# Altium schematic sheet UBC-Thunderbots_PCB_Power__archive_chicker-v1.0_pcb__Flyback.SchDoc
size A4
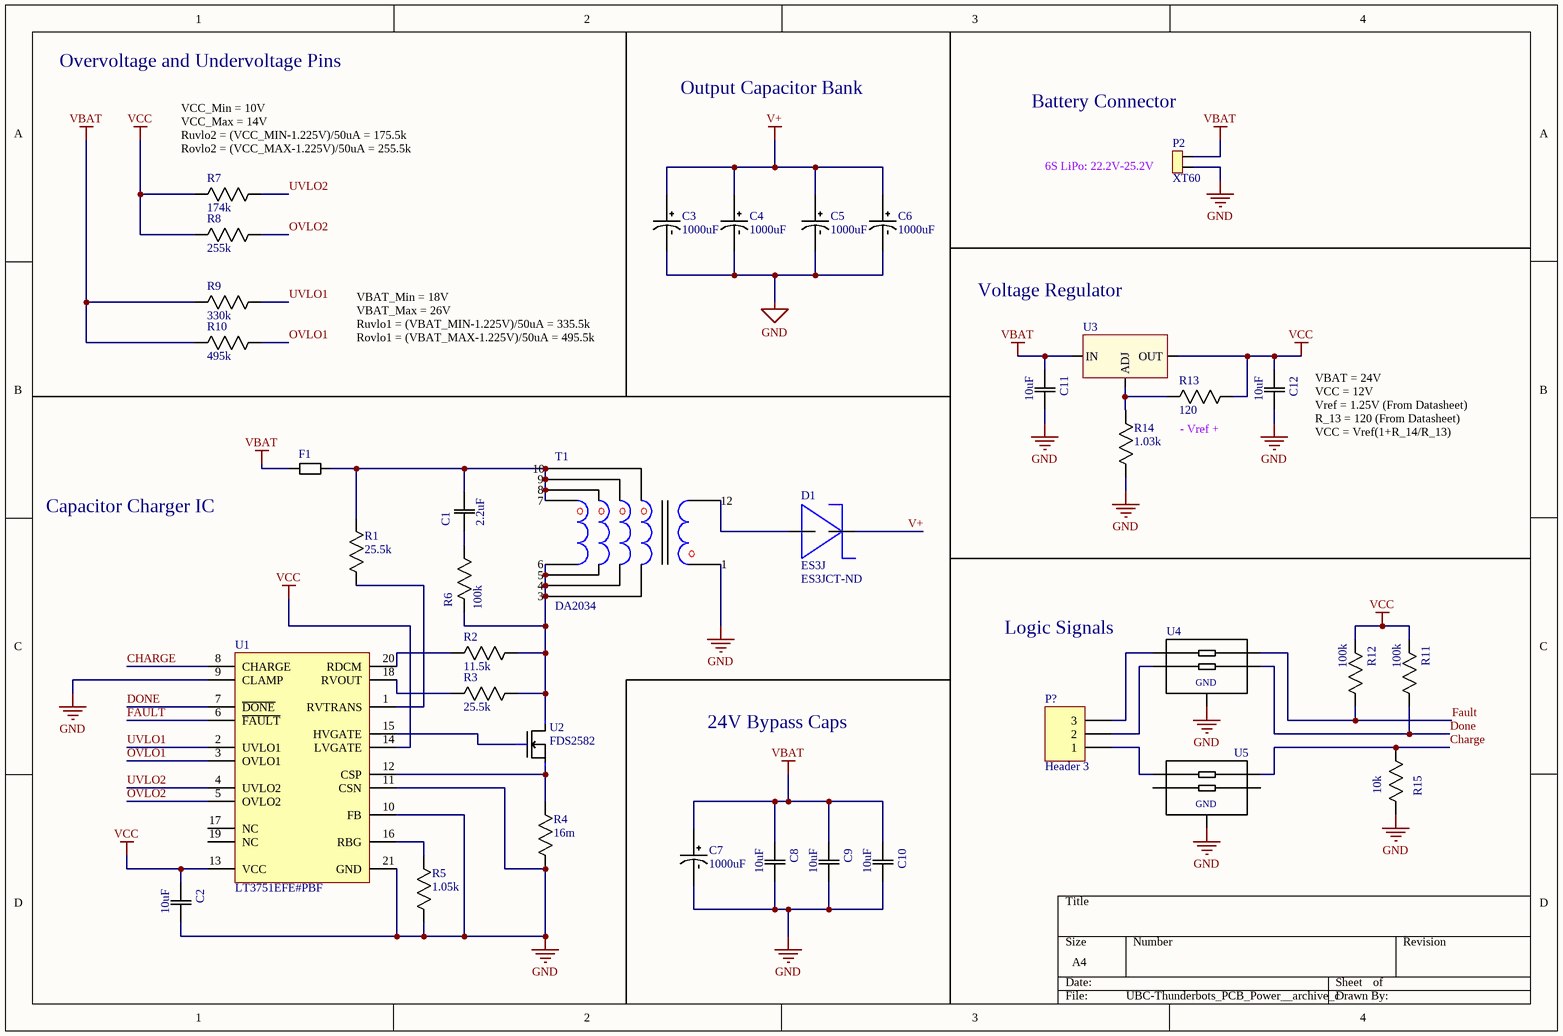
[diagram p0: UBC-Thunderbots_PCB_Power__archive_chicker-v1.0_pcb__Flyback.SchDoc]

## Parts
C1  2.2uF  [0805]
C2  10uF  [0805]
C3  1000uF  [CAP POL 1000uF THRU]
C4  1000uF  [CAP POL 1000uF THRU]
C5  1000uF  [CAP POL 1000uF THRU]
C6  1000uF  [CAP POL 1000uF THRU]
C7  1000uF  [CAP POL 1000uF THRU]
C8  10uF  [0805]
C9  10uF  [0805]
C10  10uF  [0805]
C11  10uF  [1210]
C12  10uF  [1210]
D1  ES3J  Supplier Part Number 1: ES3JCT-ND  [D0214-AB]
F1  Fuse 20A 1206  [1206]  (value not drawn)
P2  XT60  [XT60Connector]
P?  Header 3  [HDR1X3]
R1  25.5k  [0805]
R2  11.5k  [0805]
R3  25.5k  [0805]
R4  16m  [0805]
R5  1.05k  [0805]
R6  100k  [0805]
R7  174k  [0805]
R8  255k  [0805]
R9  330k  [0805]
R10  495k  [0805]
R11  100k  [0805]
R12  100k  [0805]
R13  120  [0805]
R14  1.03k  [0805]
R15  10k  [0805]
T1  DA2034  [DA2034]
U1  LT3751EFE#PBF  [LT-FE-20-EPV-CB_L]
U2  FDS2582  [8-SOIC MOSFET]
U3  LD1084V  [*TO-220]  (value not drawn)
U4  EMI  [SOT-665]  (value not drawn)
U5  EMI  [SOT-665]  (value not drawn)

## Nets
GND: C2.2(C2) C3.NEG C4.NEG C5.NEG C6.NEG C7.NEG C8.2(C2) C9.2(C2) C10.2(C2) C11.2(C2) C12.2(C2) P2.1 R4.2(R2) R5.2(R2) R14.2(R2) R15.1(R1) T1.1 U1.9(CLAMP) U1.10(FB) U1.11(CSN) U1.21(GND) U4.2(P$2) U5.2(P$2)
V+: C3.POS C4.POS C5.POS C6.POS D1.OUT
VBAT: C7.POS C8.1(C1) C9.1(C1) C10.1(C1) C11.1(C1) F1.1 P2.2 R9.2(R2) R10.2(R2) U3.1(IN)
VCC: C2.1(C1) C12.1(C1) R7.2(R2) R8.2(R2) R11.2(R2) R12.2(R2) R13.1(R1) U1.13(VCC) U1.14(LVGATE) U3.3(OUT)
CHARGE: R15.2(R2) U1.8(CHARGE) U5.5(P$5)
DONE: R11.1(R1) U1.7(~{DONE}) U4.4(P$4)
FAULT: R12.1(R1) U1.6(~{FAULT}) U4.5(P$5)
OVLO1: R10.1(R1) U1.3(OVLO1)
OVLO2: R8.1(R1) U1.5(OVLO2)
UVLO1: R9.1(R1) U1.2(UVLO1)
UVLO2: R7.1(R1) U1.4(UVLO2)
NetC1_1: C1.1(C1) R6.1(R1)
NetC1_2: C1.2(C2) F1.2 R1.1(R1) T1.7 T1.8 T1.9 T1.10
NetD1_IN: D1.IN T1.12
NetP?_1: P?.1 U5.1(P$1)
NetP?_2: P?.2 U4.3(P$3)
NetP?_3: P?.3 U4.1(P$1)
NetR1_2: R1.2(R2) U1.1(RVTRANS)
NetR2_1: R2.1(R1) R3.1(R1) R6.2(R2) T1.3 T1.4 T1.5 T1.6 U2.D
NetR2_2: R2.2(R2) U1.20(RDCM)
NetR3_2: R3.2(R2) U1.18(RVOUT)
NetR4_1: R4.1(R1) U1.12(CSP) U2.S
NetR5_1: R5.1(R1) U1.16(RBG)
NetR13_2: R13.2(R2) R14.1(R1) U3.2(ADJ)
NetU1_15: U1.15(HVGATE) U2.G

Not connected (* = marked no-connect by the designer): U1 17(NC) 19(NC); U5 3(P$3) 4(P$4)

## Notes on the sheet
- Overvoltage and Undervoltage Pins
- Output Capacitor Bank
- (near P2) Battery Connector
- (near R7) VCC_Min = 10V
  VCC_Max = 14V
  Ruvlo2 = (VCC_MIN-1.225V)/50uA = 175.5k
  Rovlo2 = (VCC_MAX-1.225V)/50uA = 255.5k
- (near P2) 6S LiPo: 22.2V-25.2V
- Voltage Regulator
- VBAT_Min = 18V
  VBAT_Max = 26V
  Ruvlo1 = (VBAT_MIN-1.225V)/50uA = 335.5k
  Rovlo1 = (VBAT_MAX-1.225V)/50uA = 495.5k
- (near R13) - Vref +
- (near C12) VBAT = 24V
  VCC = 12V
  Vref = 1.25V (From Datasheet)
  R_13 = 120 (From Datasheet)
  VCC = Vref(1+R_14/R_13)
  R_14 = R_13(VCC/Vref - 1) = 1.03k
- Capacitor Charger IC
- (near U4) Logic Signals
- 24V Bypass Caps
- (in symbol EMI FILTER IP4256CZ5-W) GND

## Library data of the parts
C1 = CAP 2.2uF 0805: CAP CER 1UF 50V X7R 0805; MP: C0805C225K4RACTU; MF: KEMET; Tolerance: 10%; Rating: 16V; Package: 0805; Price: 0,461 CAD; Value: 2.2uF; Digikey: 399-3523-1-ND; Digikey Link: https://www.digikey.ca/products/en?keywords=399-3523-1-ND
C2 C8-C10 = CAP 10uF 0805: CAP CER 10UF 10V X5R 0805; MP: C0805C106K8PACTU; MF: KEMET; Tolerance: 10%; Package: 0805; Price: 0.168 CAD; Value: 10uF; Digikey: 399-4925-1-ND; Digikey Link: https://www.digikey.ca/product-detail/en/kemet/C0805C106K8PACTU/399-4925-1-ND/1090920; Rating: 10V
C3-C7 = CAP POL 1000uF THRU: NICHICON   UVR1E102MPD1TD   ALUMINUM ELECTROLYTIC CAPACITOR, 1000UF, 25V, 20%, RADIAL, FULL REEL; Dielectric Material: Aluminium; Life (Hours): 2000Hour; Capacitance: 1mF; Leakage Current: 750uA; Dissipation Factor: 0.16%; Ripple Current: 960mA; Lead Diameter: 0.6mm; Supplier 1: Digi-Key; Manufacturer: Nichicon; Manufacturer Part Number: UVR1E102MPD1TD; RoHS: Yes; Category: Aluminum Electrolytic Capacitors; Stock 1: 43448; Pricing 1: 1=0.58000, 10=0.40800, 100=0.26890 (USD); Mount: Through Hole,PCB; Case/Package: Radial; Number of Pins: 2; Min Operating Temperature: -40°C; Max Operating Temperature: 85°C; Packaging: Tape and Reel; Tolerance: 20%; Voltage Rating (DC): 25V; Voltage Rating: 25V; Termination: Radial; Voltage: 25V; Package Quantity: 500; Diameter: 10mm; Length: 20mm; Height: 20mm; Height - Seated (Max): 0.866inch; Lead Pitch: 5mm; Radiation Hardening: No; REACH SVHC: No SVHC; Lead Free: Lead Free; ComponentLink1URL: https://datasheet.ciiva.com/7851/e-vr-7851718.pdf?src-supplier=Element14; ComponentLink1Description: https://datasheet.ciiva.com/7851/e-vr-7851718.pdf?src-supplier=Element14; ComponentLink2URL: https://datasheet.ciiva.com/6300/e-vr-6300009.pdf?src-supplier=Digi-Key; ComponentLink2Description: https://datasheet.ciiva.com/6300/e-vr-6300009.pdf?src-supplier=Digi-Key; ComponentLink3URL: https://datasheet.ciiva.com/6300/e-vr-6300010.pdf?src-supplier=Digi-Key; ComponentLink3Description: https://datasheet.ciiva.com/6300/e-vr-6300010.pdf?src-supplier=Digi-Key; ComponentLink4URL: https://datasheet.ciiva.com/11684/e-vr-11684106.pdf?src-supplier=Avnet; ComponentLink4Description: https://datasheet.ciiva.com/11684/e-vr-11684106.pdf?src-supplier=Avnet; ComponentLink5URL: https://datasheet.ciiva.com/16502/e-vr-16502813.pdf?src-supplier=Future+Electronics; ComponentLink5Description: https://datasheet.ciiva.com/16502/e-vr-16502813.pdf?src-supplier=Future+Electronics; ComponentLink6URL: https://datasheet.ciiva.com/46381/1909356-46381757.pdf?src-supplier=Element14; ComponentLink6Description: https://datasheet.ciiva.com/46381/1909356-46381757.pdf?src-supplier=Element14; Supplier Part Number 1: 493-5913-1-ND
C11 C12 = CAP 10uF 50V: CAP CER 10UF 50V X7R; Tolerance: 10%; Package: 1210; Value: 10uF; Rating: 50V; ComponentLink1Description: digikey; ComponentLink1URL: https://www.digikey.ca/en/products/detail/kemet/C1210C106M5RACTU/4918883
D1 = ES3J: Diode Switching 600V 3A 2-Pin DO-214AB T/R; Manufacturer: ON Semiconductor / Fairchild; Element Configuration: Single; Power Dissipation: 1.66W; Reverse Recovery Time: 35ns; Peak Non-Repetitive Surge Current: 100A; Polarity: Standard; Capacitance: 45pF; Forward Voltage: 1.7V; Peak Reverse Current: 10uA; Supplier 1: Digi-Key; Manufacturer Part Number: ES3J; RoHS: Yes; Category: Zener Diodes; Stock 1: 20740; Pricing 1: 1=0.47000, 10=0.37800, 25=0.34600, 100=0.21740, 250=0.21492, 500=0.20126, 1000=0.13685 (USD); Mount: Surface Mount; Case/Package: SMC; Number of Pins: 2; Contact Plating: Tin,Matte; Min Operating Temperature: -50°C; Max Operating Temperature: 150°C; Reverse Voltage: 600V; Max Reverse Voltage (DC): 600V; Average Rectified Current: 3A; Max Repetitive Reverse Voltage (Vrrm): 600V; Max Forward Surge Current (Ifsm): 100A; Current: 3A; Voltage: 600V; Voltage Rating (DC): 600V; Current Rating: 3A; Output Current: 3A; Max Surge Current: 100A; Packaging: Tape and Reel; Package Quantity: 3000; Recovery Time: 35ns; Forward Current: 3A; Length: 7.11mm; Height: 2.616mm; Width: 6.223mm; Radiation Hardening: No; REACH SVHC: No SVHC; Lead Free: Lead Free; ComponentLink1URL: https://datasheet.ciiva.com/4452/es3j-187547-4452440.pdf?src-supplier=Mouser; ComponentLink1Description: https://datasheet.ciiva.com/4452/es3j-187547-4452440.pdf?src-supplier=Mouser; ComponentLink2URL: https://datasheet.ciiva.com/30479/0900766b810e1d0b-30479500.pdf?src-supplier=RSComponents; ComponentLink2Description: https://datasheet.ciiva.com/30479/0900766b810e1d0b-30479500.pdf?src-supplier=RSComponents; ComponentLink3URL: https://datasheet.ciiva.com/22651/1856389-22651960.pdf?src-supplier=Element14; ComponentLink3Description: https://datasheet.ciiva.com/22651/1856389-22651960.pdf?src-supplier=Element14; ComponentLink4URL: https://datasheet.ciiva.com/26230/es3j-26230952.pdf?src-supplier=Avnet+Europe; ComponentLink4Description: https://datasheet.ciiva.com/26230/es3j-26230952.pdf?src-supplier=Avnet+Europe; ComponentLink5URL: https://datasheet.ciiva.com/911/es3a-911003.pdf?src-supplier=Digi-Key; ComponentLink5Description: https://datasheet.ciiva.com/911/es3a-911003.pdf?src-supplier=Digi-Key; ComponentLink6URL: https://datasheet.ciiva.com/911/es3a-911004.pdf?src-supplier=Digi-Key; ComponentLink6Description: https://datasheet.ciiva.com/911/es3a-911004.pdf?src-supplier=Digi-Key; ComponentLink7URL: https://datasheet.ciiva.com/23683/1856389-23683564.pdf?src-supplier=Newark; ComponentLink7Description: https://datasheet.ciiva.com/23683/1856389-23683564.pdf?src-supplier=Newark; ComponentLink8URL: https://datasheet.ciiva.com/17194/es3j-17194703.pdf?src-supplier=Future+Electronics; ComponentLink8Description: https://datasheet.ciiva.com/17194/es3j-17194703.pdf?src-supplier=Future+Electronics; ComponentLink9URL: https://datasheet.ciiva.com/7965/1856389-7965165.pdf?src-supplier=Element14; ComponentLink9Description: https://datasheet.ciiva.com/7965/1856389-7965165.pdf?src-supplier=Element14; ComponentLink10URL: https://datasheet.ciiva.com/8300/es3j-8300861.pdf?src-supplier=Avnet; ComponentLink10Description: https://datasheet.ciiva.com/8300/es3j-8300861.pdf?src-supplier=Avnet
F1 = FUSE 20A 63V SLOW: FUSE 20A 32V AC 63V DC 1206; Response Time: Slow Blow; Current Rating (Amps): 20A; Voltage Rating - AC: 32V; Voltage Rating - DC: 63V; Operating Temperature: -55°C ~ 90°C
P2 = XT60 Connector: XT60 CONNECTORS FEMALE PAIR; MF: SparkFun Electronics; MP: PRT-10474; Digikey: 1568-1816-ND; Digikey Link: https://www.digikey.ca/product-detail/en/sparkfun-electronics/PRT-10474/1568-1816-ND/8258064; Package: XT60; Price: 2.13000 CAD; Value: N/A
P? = Header 3: Header, 3-Pin; LatestRevisionDate: 17-Jul-2002; LatestRevisionNote: Re-released for DXP Platform.; Publisher: Altium Limited
R1 R3 = RES 25.5k 0805: 0805 Resistor, 6A, 0.125W, 25ppm, 0.1%, 25K5; Manufacturer: Panasonic; Manufacturer Part Number: ERA-6AEB2552V; Temperature Coefficient: 25ppm/°C; Max Power Dissipation: 125mW; Resistance: 25.5kR; Voltage Rating: 100V; Supplier 1: Digi-Key; RoHS: Yes; Category: Chip SMD Resistors; Stock 1: 5872; Pricing 1: 1=0.36000, 10=0.30200, 100=0.11820, 1000=0.04948, 2500=0.04536 (USD); Mount: Surface Mount; Case/Package: 0805; Number of Pins: 2; Case Code (Imperial): 0805; Case Code (Metric): 2012; Contact Plating: Tin; Min Operating Temperature: -55°C; Max Operating Temperature: 155°C; Number of Terminations: 2; Features: Automotive AEC-Q200; Tolerance: 0.1%; Composition: Metal Film,Thin Film; Packaging: Tape and Reel; Military Standard: Not; Termination: Solder; Power Rating: 125mW; Package Quantity: 1; Voltage Rating (DC): 100V; Length: 2mm; Height: 0.5mm; Width: 1.25mm; Depth: 1.25mm; Radiation Hardening: No; Lead Free: Lead Free; ComponentLink1URL: https://datasheet.ciiva.com/11810/0900766b80eb1d8c-11810651.pdf?src-supplier=RSComponents; ComponentLink1Description: https://datasheet.ciiva.com/11810/0900766b80eb1d8c-11810651.pdf?src-supplier=RSComponents; ComponentLink2URL: https://datasheet.ciiva.com/26335/459526-da-01-en-widerstand-0805-era-26335831.pdf?src-supplier=Conrad; ComponentLink2Description: https://datasheet.ciiva.com/26335/459526-da-01-en-widerstand-0805-era-26335831.pdf?src-supplier=Conrad; ComponentLink3URL: https://datasheet.ciiva.com/7870/485442-7870651.pdf?src-supplier=Element14; ComponentLink3Description: https://datasheet.ciiva.com/7870/485442-7870651.pdf?src-supplier=Element14; ComponentLink4URL: https://datasheet.ciiva.com/5987/485442-5987308.pdf?src-supplier=Farnell; ComponentLink4Description: https://datasheet.ciiva.com/5987/485442-5987308.pdf?src-supplier=Farnell; ComponentLink5URL: https://datasheet.ciiva.com/7870/485442-7870652.pdf?src-supplier=Element14; ComponentLink5Description: https://datasheet.ciiva.com/7870/485442-7870652.pdf?src-supplier=Element14; ComponentLink6URL: https://datasheet.ciiva.com/30151/54aoa0000ce26-30151583.pdf?src-supplier=Onlinecomponents.com; ComponentLink6Description: https://datasheet.ciiva.com/30151/54aoa0000ce26-30151583.pdf?src-supplier=Onlinecomponents.com; ComponentLink7URL: https://datasheet.ciiva.com/9191/aoa0000ce26-9191422.pdf?src-supplier=Avnet; ComponentLink7Description: https://datasheet.ciiva.com/9191/aoa0000ce26-9191422.pdf?src-supplier=Avnet; Supplier Part Number 1: P25.5KDACT-ND
R2 = RES 11.5k 0805: Res Thin Film 0805 11.5K Ohm 0.1% 1/8W 25ppm/C Molded SMD SMD Punched Carrier T/R; Manufacturer: Panasonic; Manufacturer Part Number: ERA-6AEB1152V; Power Rating: 125mW; Resistance: 11.5kR; Voltage Rating: 100V; Temperature Coefficient: 25ppm/°C; Supplier 1: Digi-Key; RoHS: Yes; Category: Chip SMD Resistors; Stock 1: 10661; Pricing 1: 1=0.34000, 10=0.28800, 100=0.11260, 1000=0.04712, 2500=0.04320 (USD); Mount: Surface Mount; Case/Package: 0805; Number of Pins: 2; Case Code (Metric): 2012; Case Code (Imperial): 0805; Contact Plating: Tin; Min Operating Temperature: -55°C; Max Operating Temperature: 155°C; Tolerance: 0.1%; Packaging: Tape and Reel; Max Power Dissipation: 125mW; Composition: Thin Film,Metal Film; Number of Terminations: 2; Voltage Rating (DC): 100V; Termination: Solder; Military Standard: Not; Package Quantity: 1; Features: Automotive AEC-Q200; Length: 2mm; Height: 0.5mm; Width: 1.25mm; Depth: 1.25mm; Radiation Hardening: No; Lead Free: Lead Free; ComponentLink1URL: https://datasheet.ciiva.com/11810/0900766b80eb1d8c-11810868.pdf?src-supplier=RSComponents; ComponentLink1Description: https://datasheet.ciiva.com/11810/0900766b80eb1d8c-11810868.pdf?src-supplier=RSComponents; ComponentLink2URL: https://datasheet.ciiva.com/41450/001181306-da-01-en-widerstand-era-0805-11k5-0-1-5000st-41450464.pdf?src-supplier=Conrad; ComponentLink2Description: https://datasheet.ciiva.com/41450/001181306-da-01-en-widerstand-era-0805-11k5-0-1-5000st-41450464.pdf?src-supplier=Conrad; ComponentLink3URL: https://datasheet.ciiva.com/5987/485442-5987301.pdf?src-supplier=Farnell; ComponentLink3Description: https://datasheet.ciiva.com/5987/485442-5987301.pdf?src-supplier=Farnell; ComponentLink4URL: https://datasheet.ciiva.com/7829/485442-7829142.pdf?src-supplier=Element14; ComponentLink4Description: https://datasheet.ciiva.com/7829/485442-7829142.pdf?src-supplier=Element14; ComponentLink5URL: https://datasheet.ciiva.com/17211/aoa0000ce26-17211855.pdf?src-supplier=Avnet+Europe; ComponentLink5Description: https://datasheet.ciiva.com/17211/aoa0000ce26-17211855.pdf?src-supplier=Avnet+Europe; ComponentLink6URL: https://datasheet.ciiva.com/7829/485442-7829143.pdf?src-supplier=Element14; ComponentLink6Description: https://datasheet.ciiva.com/7829/485442-7829143.pdf?src-supplier=Element14; ComponentLink7URL: https://datasheet.ciiva.com/9193/aoa0000ce26-9193735.pdf?src-supplier=Avnet; ComponentLink7Description: https://datasheet.ciiva.com/9193/aoa0000ce26-9193735.pdf?src-supplier=Avnet; ComponentLink8URL: https://datasheet.ciiva.com/24024/aoa0000ce26-197354-24024328.pdf?src-supplier=Mouser; ComponentLink8Description: https://datasheet.ciiva.com/24024/aoa0000ce26-197354-24024328.pdf?src-supplier=Mouser; Supplier Part Number 1: P11.5KDACT-ND
R4 = RES 16mOhm 0805: Res Thick Film 0805 0.016 Ohm 1% 0.5W(1/2W) ±200ppm/C Molded SMD Automotive Punched T/R; Manufacturer: Panasonic; Manufacturer Part Number: ERJ-6BWFR016V; Resistance: 16mR; Power Rating: 500mW; Temperature Coefficient: 200ppm/°C; Supplier 1: Digi-Key; RoHS: Yes; Category: Chip SMD Resistors; Stock 1: 4585; Pricing 1: 1=0.65000, 10=0.53800, 100=0.36140, 1000=0.21148, 2500=0.20917 (USD); Mount: Surface Mount; Case/Package: 0805; Number of Pins: 2; Contact Plating: Tin; Case Code (Metric): 2012; Case Code (Imperial): 0805; Min Operating Temperature: -55°C; Max Operating Temperature: 155°C; Tolerance: 1%; Packaging: Tape and Reel; Package Quantity: 1; Features: Automotive AEC-Q200; Max Power Dissipation: 500mW; Composition: Thick Film; Number of Terminations: 2; Termination: SMD/SMT; Military Standard: Not; Length: 2mm; Height: 0.028inch; Width: 0.049inch; Depth: 1.25mm; Radiation Hardening: No; Lead Free: Lead Free; ComponentLink1URL: https://datasheet.ciiva.com/11808/0900766b8126441d-11808690.pdf?src-supplier=RSComponents; ComponentLink1Description: https://datasheet.ciiva.com/11808/0900766b8126441d-11808690.pdf?src-supplier=RSComponents; ComponentLink2URL: https://datasheet.ciiva.com/2452/aoa0000ce3-2452594.pdf?src-supplier=Digi-Key; ComponentLink2Description: https://datasheet.ciiva.com/2452/aoa0000ce3-2452594.pdf?src-supplier=Digi-Key; ComponentLink3URL: https://datasheet.ciiva.com/2452/aoa0000ce3-2452592.pdf?src-supplier=Digi-Key; ComponentLink3Description: https://datasheet.ciiva.com/2452/aoa0000ce3-2452592.pdf?src-supplier=Digi-Key; ComponentLink4URL: https://datasheet.ciiva.com/2452/aoa0000ce3-2452593.pdf?src-supplier=Digi-Key; ComponentLink4Description: https://datasheet.ciiva.com/2452/aoa0000ce3-2452593.pdf?src-supplier=Digi-Key; ComponentLink5URL: https://datasheet.ciiva.com/9192/aoa0000ce3-9192761.pdf?src-supplier=Avnet; ComponentLink5Description: https://datasheet.ciiva.com/9192/aoa0000ce3-9192761.pdf?src-supplier=Avnet; ComponentLink6URL: https://datasheet.ciiva.com/17211/aoa0000ce3-17211370.pdf?src-supplier=Avnet+Europe; ComponentLink6Description: https://datasheet.ciiva.com/17211/aoa0000ce3-17211370.pdf?src-supplier=Avnet+Europe; Supplier Part Number 1: P.016AQCT-ND
R5 = RES 1.05k 0805: Res Thin Film 0805 10.5K Ohm 0.1% 0.125W(1/8W) ±25ppm/C Molded SMD Automotive Punched T/R; Manufacturer: Panasonic; Manufacturer Part Number: ERA-6AEB1052V; Resistance: 10.5kR; Power Rating: 125mW; Voltage Rating: 100V; Temperature Coefficient: 25ppm/°C; Supplier 1: Digi-Key; RoHS: Yes; Category: Chip SMD Resistors; Stock 1: 21208; Pricing 1: 1=0.34000, 10=0.28800, 100=0.11260, 1000=0.04712, 2500=0.04320 (USD); Mount: Surface Mount; Case/Package: 0805; Number of Pins: 2; Case Code (Metric): 2012; Case Code (Imperial): 0805; Contact Plating: Tin; Min Operating Temperature: -55°C; Max Operating Temperature: 155°C; Tolerance: 0.1%; Packaging: Tape and Reel; Composition: Thin Film,Metal Film; Package Quantity: 1; Max Power Dissipation: 125mW; Number of Terminations: 2; Termination: Solder; Voltage Rating (DC): 100V; Features: Automotive AEC-Q200; Military Standard: Not; Length: 2mm; Height: 0.5mm; Width: 1.25mm; Depth: 1.25mm; Radiation Hardening: No; Lead Free: Lead Free; REACH SVHC: No SVHC; ComponentLink1URL: https://datasheet.ciiva.com/11810/0900766b80eb1d8c-11810443.pdf?src-supplier=RSComponents; ComponentLink1Description: https://datasheet.ciiva.com/11810/0900766b80eb1d8c-11810443.pdf?src-supplier=RSComponents; ComponentLink2URL: https://datasheet.ciiva.com/41450/001181303-da-01-en-widerstand-era-0805-10k5-0-1-5000st-41450463.pdf?src-supplier=Conrad; ComponentLink2Description: https://datasheet.ciiva.com/41450/001181303-da-01-en-widerstand-era-0805-10k5-0-1-5000st-41450463.pdf?src-supplier=Conrad; ComponentLink3URL: https://datasheet.ciiva.com/5987/485442-5987261.pdf?src-supplier=Farnell; ComponentLink3Description: https://datasheet.ciiva.com/5987/485442-5987261.pdf?src-supplier=Farnell; ComponentLink4URL: https://datasheet.ciiva.com/17211/aoa0000ce26-17211965.pdf?src-supplier=Avnet+Europe; ComponentLink4Description: https://datasheet.ciiva.com/17211/aoa0000ce26-17211965.pdf?src-supplier=Avnet+Europe; ComponentLink5URL: https://datasheet.ciiva.com/9194/aoa0000ce26-9194028.pdf?src-supplier=Avnet; ComponentLink5Description: https://datasheet.ciiva.com/9194/aoa0000ce26-9194028.pdf?src-supplier=Avnet; ComponentLink6URL: https://datasheet.ciiva.com/5987/485442-5987263.pdf?src-supplier=Farnell; ComponentLink6Description: https://datasheet.ciiva.com/5987/485442-5987263.pdf?src-supplier=Farnell; Supplier Part Number 1: P10.5KDACT-ND
R6 R11 R12 = RES 100k 0805: RES SMD 100K OHM 1% 1/8W 0805; MP: RC0805FR-07100KL; MF: Yageo; Rating: 0.125W; Digikey: 311-100KCRCT-ND; Price: 0.058 CAD; Package: 0805; Value: 100k; Digikey Link: https://www.digikey.ca/products/en?keywords=311-100KCRCT-ND; Tolerance: 1%
R7 = RES 174k 0805: RES SMD 174K OHM 1% 1/8W 0805; Manufacturer: Yageo; Manufacturer Part Number: RC0805FR-07174KL; Max Power Dissipation: 125mW; Resistance: 174kR; Temperature Coefficient: 100ppm/°C; Voltage Rating: 150V; Supplier 1: Digi-Key; RoHS: Yes; Category: Chip SMD Resistors; Stock 1: 27863; Pricing 1: 1=0.10000, 10=0.04000, 100=0.01630, 1000=0.00731, 2500=0.00635 (USD); Case/Package: 0805; Case Code (Metric): 2012; Case Code (Imperial): 0805; Contact Plating: Tin,Matte; Min Operating Temperature: -55°C; Max Operating Temperature: 155°C; Package Quantity: 1; Power Rating: 125mW; Tolerance: 1%; Packaging: Tape and Reel; Features: Moisture Resistant; Composition: Thick Film; Number of Terminations: 2; Termination: SMD/SMT; Military Standard: Not; Voltage Rating (DC): 150V; Length: 2mm; Height: 0.024inch; Width: 0.049inch; Depth: 1.25mm; Radiation Hardening: No; Lead Free: Lead Free; ComponentLink1URL: https://datasheet.ciiva.com/2509/pyu-r-int-thick-7-2509472.pdf?src-supplier=Digi-Key; ComponentLink1Description: https://datasheet.ciiva.com/2509/pyu-r-int-thick-7-2509472.pdf?src-supplier=Digi-Key; ComponentLink2URL: https://datasheet.ciiva.com/2509/pyu-r-int-thick-7-2509471.pdf?src-supplier=Digi-Key; ComponentLink2Description: https://datasheet.ciiva.com/2509/pyu-r-int-thick-7-2509471.pdf?src-supplier=Digi-Key; ComponentLink3URL: https://datasheet.ciiva.com/2509/pyu-r-int-thick-7-2509473.pdf?src-supplier=Digi-Key; ComponentLink3Description: https://datasheet.ciiva.com/2509/pyu-r-int-thick-7-2509473.pdf?src-supplier=Digi-Key; Supplier Part Number 1: 311-174KCRCT-ND
R8 = RES 255k 0805: 0805 Resistor, 6A, 0.125W, 25ppm, 0.1%, 255K; Manufacturer: Panasonic; Manufacturer Part Number: ERA-6AEB2553V; Max Power Dissipation: 125mW; Resistance: 255kR; Temperature Coefficient: 25ppm/°C; Voltage Rating (DC): 100V; Voltage Rating: 200V; Supplier 1: Digi-Key; RoHS: Yes; Category: Chip SMD Resistors; Stock 1: 7869; Pricing 1: 1=0.36000, 10=0.30200, 100=0.11820, 1000=0.04948, 2500=0.04536 (USD); Mount: Surface Mount; Case/Package: 0805; Number of Pins: 2; Weight: 0.000194oz; Case Code (Imperial): 0805; Case Code (Metric): 2012; Contact Plating: Tin; Min Operating Temperature: -55°C; Max Operating Temperature: 155°C; Features: Automotive AEC-Q200; Tolerance: 0.1%; Number of Terminations: 2; Packaging: Tape and Reel; Composition: Metal Film,Thin Film; Power Rating: 125mW; Termination: SMD/SMT; Military Standard: Not; Package Quantity: 1; Length: 2mm; Height: 0.5mm; Width: 1.25mm; Depth: 1.25mm; Radiation Hardening: No; Lead Free: Lead Free; REACH SVHC: No SVHC; ComponentLink1URL: https://datasheet.ciiva.com/11810/0900766b80eb1d8c-11810615.pdf?src-supplier=RSComponents; ComponentLink1Description: https://datasheet.ciiva.com/11810/0900766b80eb1d8c-11810615.pdf?src-supplier=RSComponents; ComponentLink2URL: https://datasheet.ciiva.com/41450/001181380-da-01-en-widerstand-era-0805-255k-0-1-5000st-41450539.pdf?src-supplier=Conrad; ComponentLink2Description: https://datasheet.ciiva.com/41450/001181380-da-01-en-widerstand-era-0805-255k-0-1-5000st-41450539.pdf?src-supplier=Conrad; ComponentLink3URL: https://datasheet.ciiva.com/5981/485442-5981317.pdf?src-supplier=Farnell; ComponentLink3Description: https://datasheet.ciiva.com/5981/485442-5981317.pdf?src-supplier=Farnell; ComponentLink4URL: https://datasheet.ciiva.com/5981/485442-5981318.pdf?src-supplier=Farnell; ComponentLink4Description: https://datasheet.ciiva.com/5981/485442-5981318.pdf?src-supplier=Farnell; ComponentLink5URL: https://datasheet.ciiva.com/5981/485442-5981319.pdf?src-supplier=Farnell; ComponentLink5Description: https://datasheet.ciiva.com/5981/485442-5981319.pdf?src-supplier=Farnell; ComponentLink6URL: https://datasheet.ciiva.com/5981/485442-5981320.pdf?src-supplier=Farnell; ComponentLink6Description: https://datasheet.ciiva.com/5981/485442-5981320.pdf?src-supplier=Farnell; ComponentLink7URL: https://datasheet.ciiva.com/17206/aoa0000ce26-17206655.pdf?src-supplier=Avnet+Europe; ComponentLink7Description: https://datasheet.ciiva.com/17206/aoa0000ce26-17206655.pdf?src-supplier=Avnet+Europe; Supplier Part Number 1: P255KDACT-ND
R9 = RES 330k 0805: RES SMD 274K OHM 1% 1/8W 0805
R10 = RES 495k 0805: RES SMD 499K OHM 1% 1/8W 0805; Manufacturer: Yageo; Manufacturer Part Number: RC0805FR-07499KL; Temperature Coefficient: 100ppm/°C; Voltage Rating (DC): 150V; Resistance: 499kR; Power Rating: 125mW; Supplier 1: Digi-Key; RoHS: Yes; Category: Chip SMD Resistors; Stock 1: 2275; Pricing 1: 1=0.10000, 10=0.04000, 100=0.01630, 1000=0.00731, 2500=0.00635 (USD); Case/Package: 0805; Case Code (Metric): 2012; Case Code (Imperial): 0805; Contact Plating: Tin,Lead,Matte; Min Operating Temperature: -55°C; Max Operating Temperature: 155°C; Termination: SMD/SMT; Composition: Thick Film; Military Standard: Not; Tolerance: 1%; Voltage Rating: 150V; Packaging: Tape and Reel; Length: 2mm; Depth: 1.25mm; Radiation Hardening: No; Lead Free: Lead Free; ComponentLink1URL: https://datasheet.ciiva.com/15189/getdatasheetpartid-326570-15189975.pdf?src-supplier=Verical; ComponentLink1Description: https://datasheet.ciiva.com/15189/getdatasheetpartid-326570-15189975.pdf?src-supplier=Verical; Supplier Part Number 1: 311-499KCRCT-ND
R13 = RES 120 0805: RES SMD 120 OHM 0805
R14 = RES 1.03k 0805: RES SMD 1.03K 0805
R15 = RES 10k 1/8W: RES SMD 10K OHM 1% 1/8W 0805; Power (Watts): 0.125W; Package: 0805; Value: 10k; Tolerance: 1%
T1 = DA2034: Audio Transformers / Signal Transformers DA2032 Cap Chrgr For Linear LT3750/51
U1 = LT3751EFE#PBF: Controller to 20-Pin TSSOP EP; Manufacturer: Analog Devices / Linear Technology; Output Voltage: 500V; Output Current: 150mA; Max Input Voltage: 24V; Min Supply Voltage: 4.75V; Number of Outputs: 1; Operating Supply Current: 5.5mA; Supplier 1: Digi-Key; Manufacturer Part Number: LT3751EFE#PBF; RoHS: Yes; Category: Voltage Regulators - Switching; Stock 1: 1231; Pricing 1: 1=9.26000, 25=6.14640, 100=5.08200, 250=4.82792, 500=4.71900 (USD); Case/Package: TSSOP; Number of Pins: 20; Min Operating Temperature: -40°C; Max Operating Temperature: 125°C; Package Quantity: 74; Packaging: Rail/Tube; Termination: SMD/SMT; Max Supply Voltage: 24V; Radiation Hardening: No; REACH SVHC: No SVHC; ComponentLink1URL: https://datasheet.ciiva.com/15104/getdatasheetpartid-472813-15104438.pdf?src-supplier=Verical; ComponentLink1Description: https://datasheet.ciiva.com/15104/getdatasheetpartid-472813-15104438.pdf?src-supplier=Verical; ComponentLink2URL: https://datasheet.ciiva.com/31429/1692507-31429494.pdf?src-supplier=Farnell; ComponentLink2Description: https://datasheet.ciiva.com/31429/1692507-31429494.pdf?src-supplier=Farnell; ComponentLink3URL: https://datasheet.ciiva.com/1964/27024-1964843.pdf?src-supplier=Digi-Key; ComponentLink3Description: https://datasheet.ciiva.com/1964/27024-1964843.pdf?src-supplier=Digi-Key
U2 = FDS2582: N-Channel 150V 4.1A (Ta) 2.5W (Ta) Surface Mount 8-SOIC; MF: ON Semiconductor; MP: FDS2582; Digikey: FDS2582CT-ND; Price: 0.98 CAD; Rating: 150V; Digikey Link: https://www.digikey.com/product-detail/en/on-semiconductor/FDS2582/FDS2582CT-ND/3025307; Package: 8-SOIC
U3 = LD1084V: STMICROELECTRONICS         LD1084V            LDO Voltage Regulator, Adjustable, 30V in, 1.3V drop, 5A out, TO-220-3; Interface: SPI,Serial; Access Time: 60ns; Output Voltage: 28V; Number of Outputs: 1; Output Voltage Accuracy: 1%; Max Frequency: 5MHz; Input Bias Current: 5mA; Reference Voltage: 1.25V; Polarity: Positive; Quiescent Current: 10mA; Min Output Voltage: 2.5V; Density: 128Kb; Min Input Voltage: 4.25V; Supplier 1: Digi-Key; Manufacturer: STMicroelectronics; Manufacturer Part Number: LD1084V; RoHS: Yes; Category: Voltage Regulators - Linear; Stock 1: 3520; Pricing 1: 1=1.30000, 10=1.16200, 25=1.10320, 100=0.84710, 250=0.74860, 500=0.70920, 1000=0.55160, 2500=0.52402, 5000=0.50432 (USD); Mount: Through Hole; Case/Package: TO; Number of Pins: 3; Min Operating Temperature: -40°C; Max Operating Temperature: 125°C; Dropout Voltage: 1.3V; Package Quantity: 50; Max Input Voltage: 30V; Output Current: 5A; Packaging: Rail/Tube; Max Output Current: 5A; Number of Regulators: 1; Output Type: Adjustable; Accuracy: 1%; Length: 10.4mm; Height: 9.15mm; Width: 4.6mm; Radiation Hardening: No; REACH SVHC: No SVHC; Lead Free: Lead Free; ComponentLink1URL: https://datasheet.ciiva.com/15111/getdatasheetpartid-64852-15111283.pdf?src-supplier=Verical; ComponentLink1Description: https://datasheet.ciiva.com/15111/getdatasheetpartid-64852-15111283.pdf?src-supplier=Verical; ComponentLink2URL: https://datasheet.ciiva.com/27052/1390160-27052164.pdf?src-supplier=Jameco; ComponentLink2Description: https://datasheet.ciiva.com/27052/1390160-27052164.pdf?src-supplier=Jameco; ComponentLink3URL: https://datasheet.ciiva.com/1511/1786011-1511541.pdf?src-supplier=Element14; ComponentLink3Description: https://datasheet.ciiva.com/1511/1786011-1511541.pdf?src-supplier=Element14; ComponentLink4URL: https://datasheet.ciiva.com/16496/cd00003086-16496021.pdf?src-supplier=Future+Electronics; ComponentLink4Description: https://datasheet.ciiva.com/16496/cd00003086-16496021.pdf?src-supplier=Future+Electronics; ComponentLink5URL: https://datasheet.ciiva.com/2045/cd00003086-2045335.pdf?src-supplier=Digi-Key; ComponentLink5Description: https://datasheet.ciiva.com/2045/cd00003086-2045335.pdf?src-supplier=Digi-Key; Supplier Part Number 1: 497-3413-5-ND
U4 U5 = EMI FILTER IP4256CZ5-W: FILTER RC(PI) 100 OHM/19PF SMD; MF: Nexperia USA Inc.; MP: IP4256CZ5-W,115; SnapEDA_Link: https://www.snapeda.com/parts/IP4256CZ5-W/Nexperia%20USA%20Inc./view-part/3605439/?ref=snap; Price: 0.17 CAD; Package: SOT-665; Digikey: 1727-4718-1-ND; Digikey Link: https://www.digikey.ca/product-detail/en/nexperia-usa-inc/IP4256CZ5-W115/1727-4718-1-ND/2531158